# Altium schematic sheet TL494.SchDoc
size 381 x 241 mm
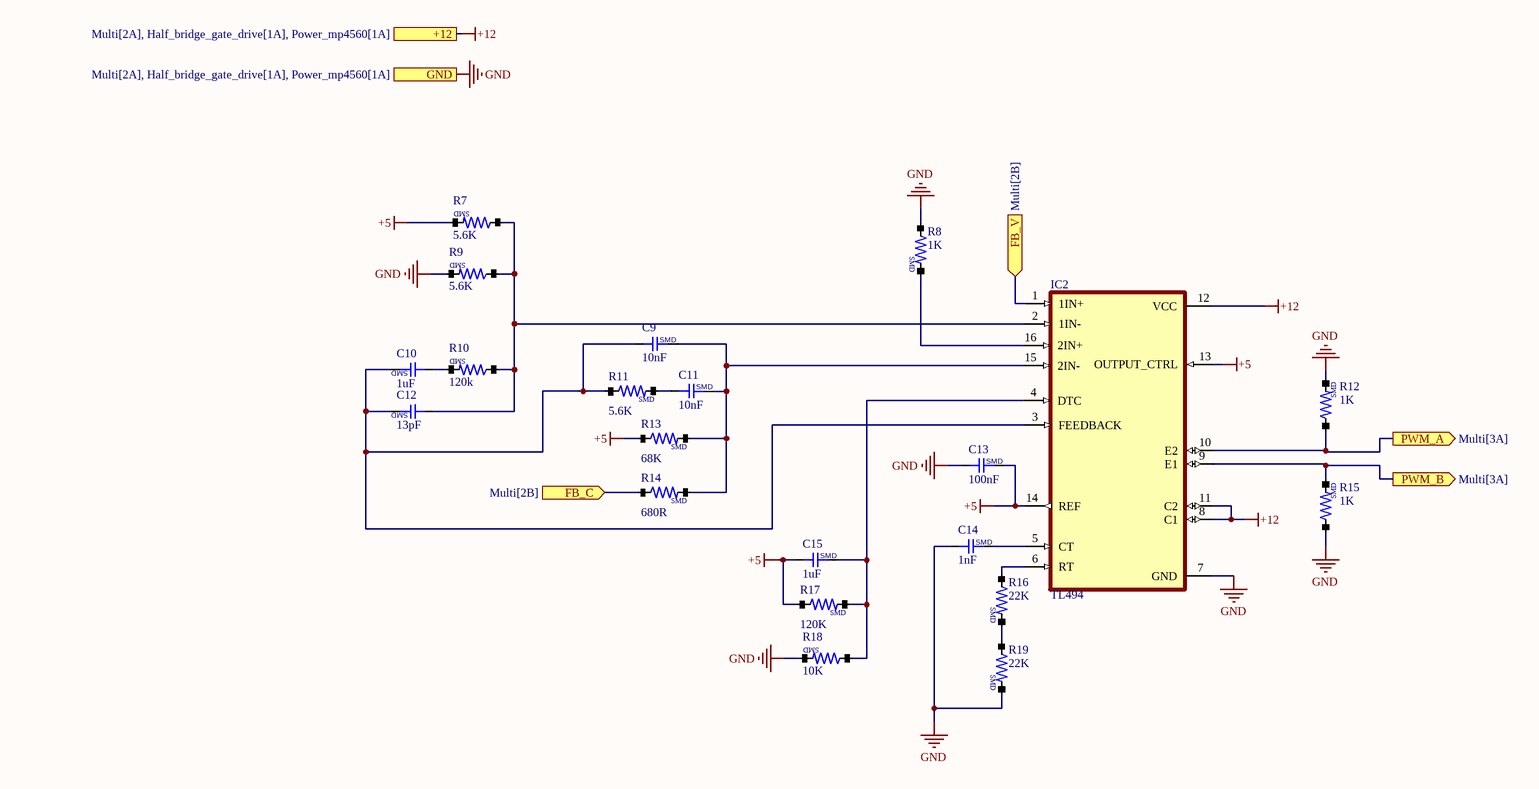
[diagram p0: TL494.SchDoc]

## Parts
C9  10nF  [CAP-0603]
C10  1uF  [CAP-0603]
C11  10nF  [CAP-0603]
C12  13pF  [CAP-0603]
C13  100nF  [CAP-0603]
C14  1nF  [CAP-0603]
C15  1uF  [CAP-0805]
IC2  TL494  [TL494_SMD]
R7  5.6K  [RES/0603]
R8  1K  [RES/0603]
R9  5.6K  [RES/0603]
R10  120k  [RES/0603]
R11  5.6K  [RES/0603]
R12  1K  [RES/0603]
R13  68K  [RES/0603]
R14  680R  [RES/0603]
R15  1K  [RES/0603]
R16  22K  [RES/0603]
R17  120K  [RES/0603]
R18  10K  [RES/0603]
R19  22K  [RES/0603]

## Ports
+12 (see Multi[2A], Half_bridge_gate_drive[1A], Power_mp4560[1A]), FB_C (in, see Multi[2B]), FB_V (in, see Multi[2B]), GND (see Multi[2A], Half_bridge_gate_drive[1A], Power_mp4560[1A]), PWM_A (out, see Multi[3A]), PWM_B (out, see Multi[3A])

## Nets
+5: C13.2 C15.1 IC2.13(OUTPUT_CTRL) IC2.14(REF) R7.2 R13.1 R17.1
+12: IC2.8(C1) IC2.11(C2) IC2.12(VCC) ; port +12
GND: C13.1 C14.1 IC2.7(GND) R8.1 R9.2 R12.2 R15.1 R18.2 R19.2 ; port GND
FB_C: R14.1 ; port FB_C
FB_V: IC2.1(1IN+) ; port FB_V
PWM_A: IC2.10(E2) R12.1 ; port PWM_A
PWM_B: IC2.9(E1) R15.2 ; port PWM_B
NetC9_1: C9.1 C10.2 C12.2 IC2.3(FEEDBACK) R11.1
NetC9_2: C9.2 C11.2 IC2.15(2IN-) R13.2 R14.2
NetC10_1: C10.1 R10.2
NetC11_1: C11.1 R11.2
NetC12_1: C12.1 IC2.2(1IN-) R7.1 R9.1 R10.1
NetC14_2: C14.2 IC2.5(CT)
NetC15_2: C15.2 IC2.4(DTC) R17.2 R18.1
NetIC2_6: IC2.6(RT) R16.1
NetIC2_16: IC2.16(2IN+) R8.2
NetR16_2: R16.2 R19.1

## Notes on the sheet
- (in symbol cap_smd) SMD
- (in symbol RES/SMD) SMD

## Library data of the parts
C9-C15 = cap_smd
R7-R19 = RES/SMD